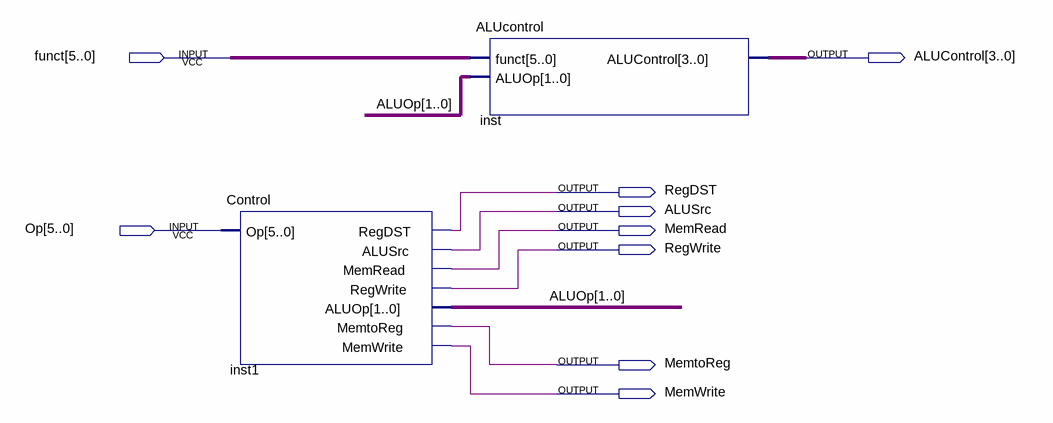
[diagram p0: schematic sheet]
// Quartus schematic ControlUnit.bdf as structural Verilog: 2 symbols, 9 pins
module ControlUnit (
  input  [5:0] funct,
  input  [5:0] Op,
  output [3:0] ALUControl,
  output RegDST,
  output ALUSrc,
  output MemRead,
  output RegWrite,
  output MemtoReg,
  output MemWrite
);

  wire [1:0] ALUOp;

  Control inst1 (
    .Op(Op), .RegDST(RegDST), .ALUSrc(ALUSrc), .MemRead(MemRead), .RegWrite(RegWrite), .ALUOp(ALUOp),
    .MemtoReg(MemtoReg), .MemWrite(MemWrite));
  ALUcontrol inst (.funct(funct), .ALUOp(ALUOp), .ALUControl(ALUControl));
endmodule
